# EasyEDA schematic NOR Flash Storage Module.json
TITLE: Sheet_1; REV: 1.0; Date: 2019-08-23; Sheet: 1/1; Company: Your Company
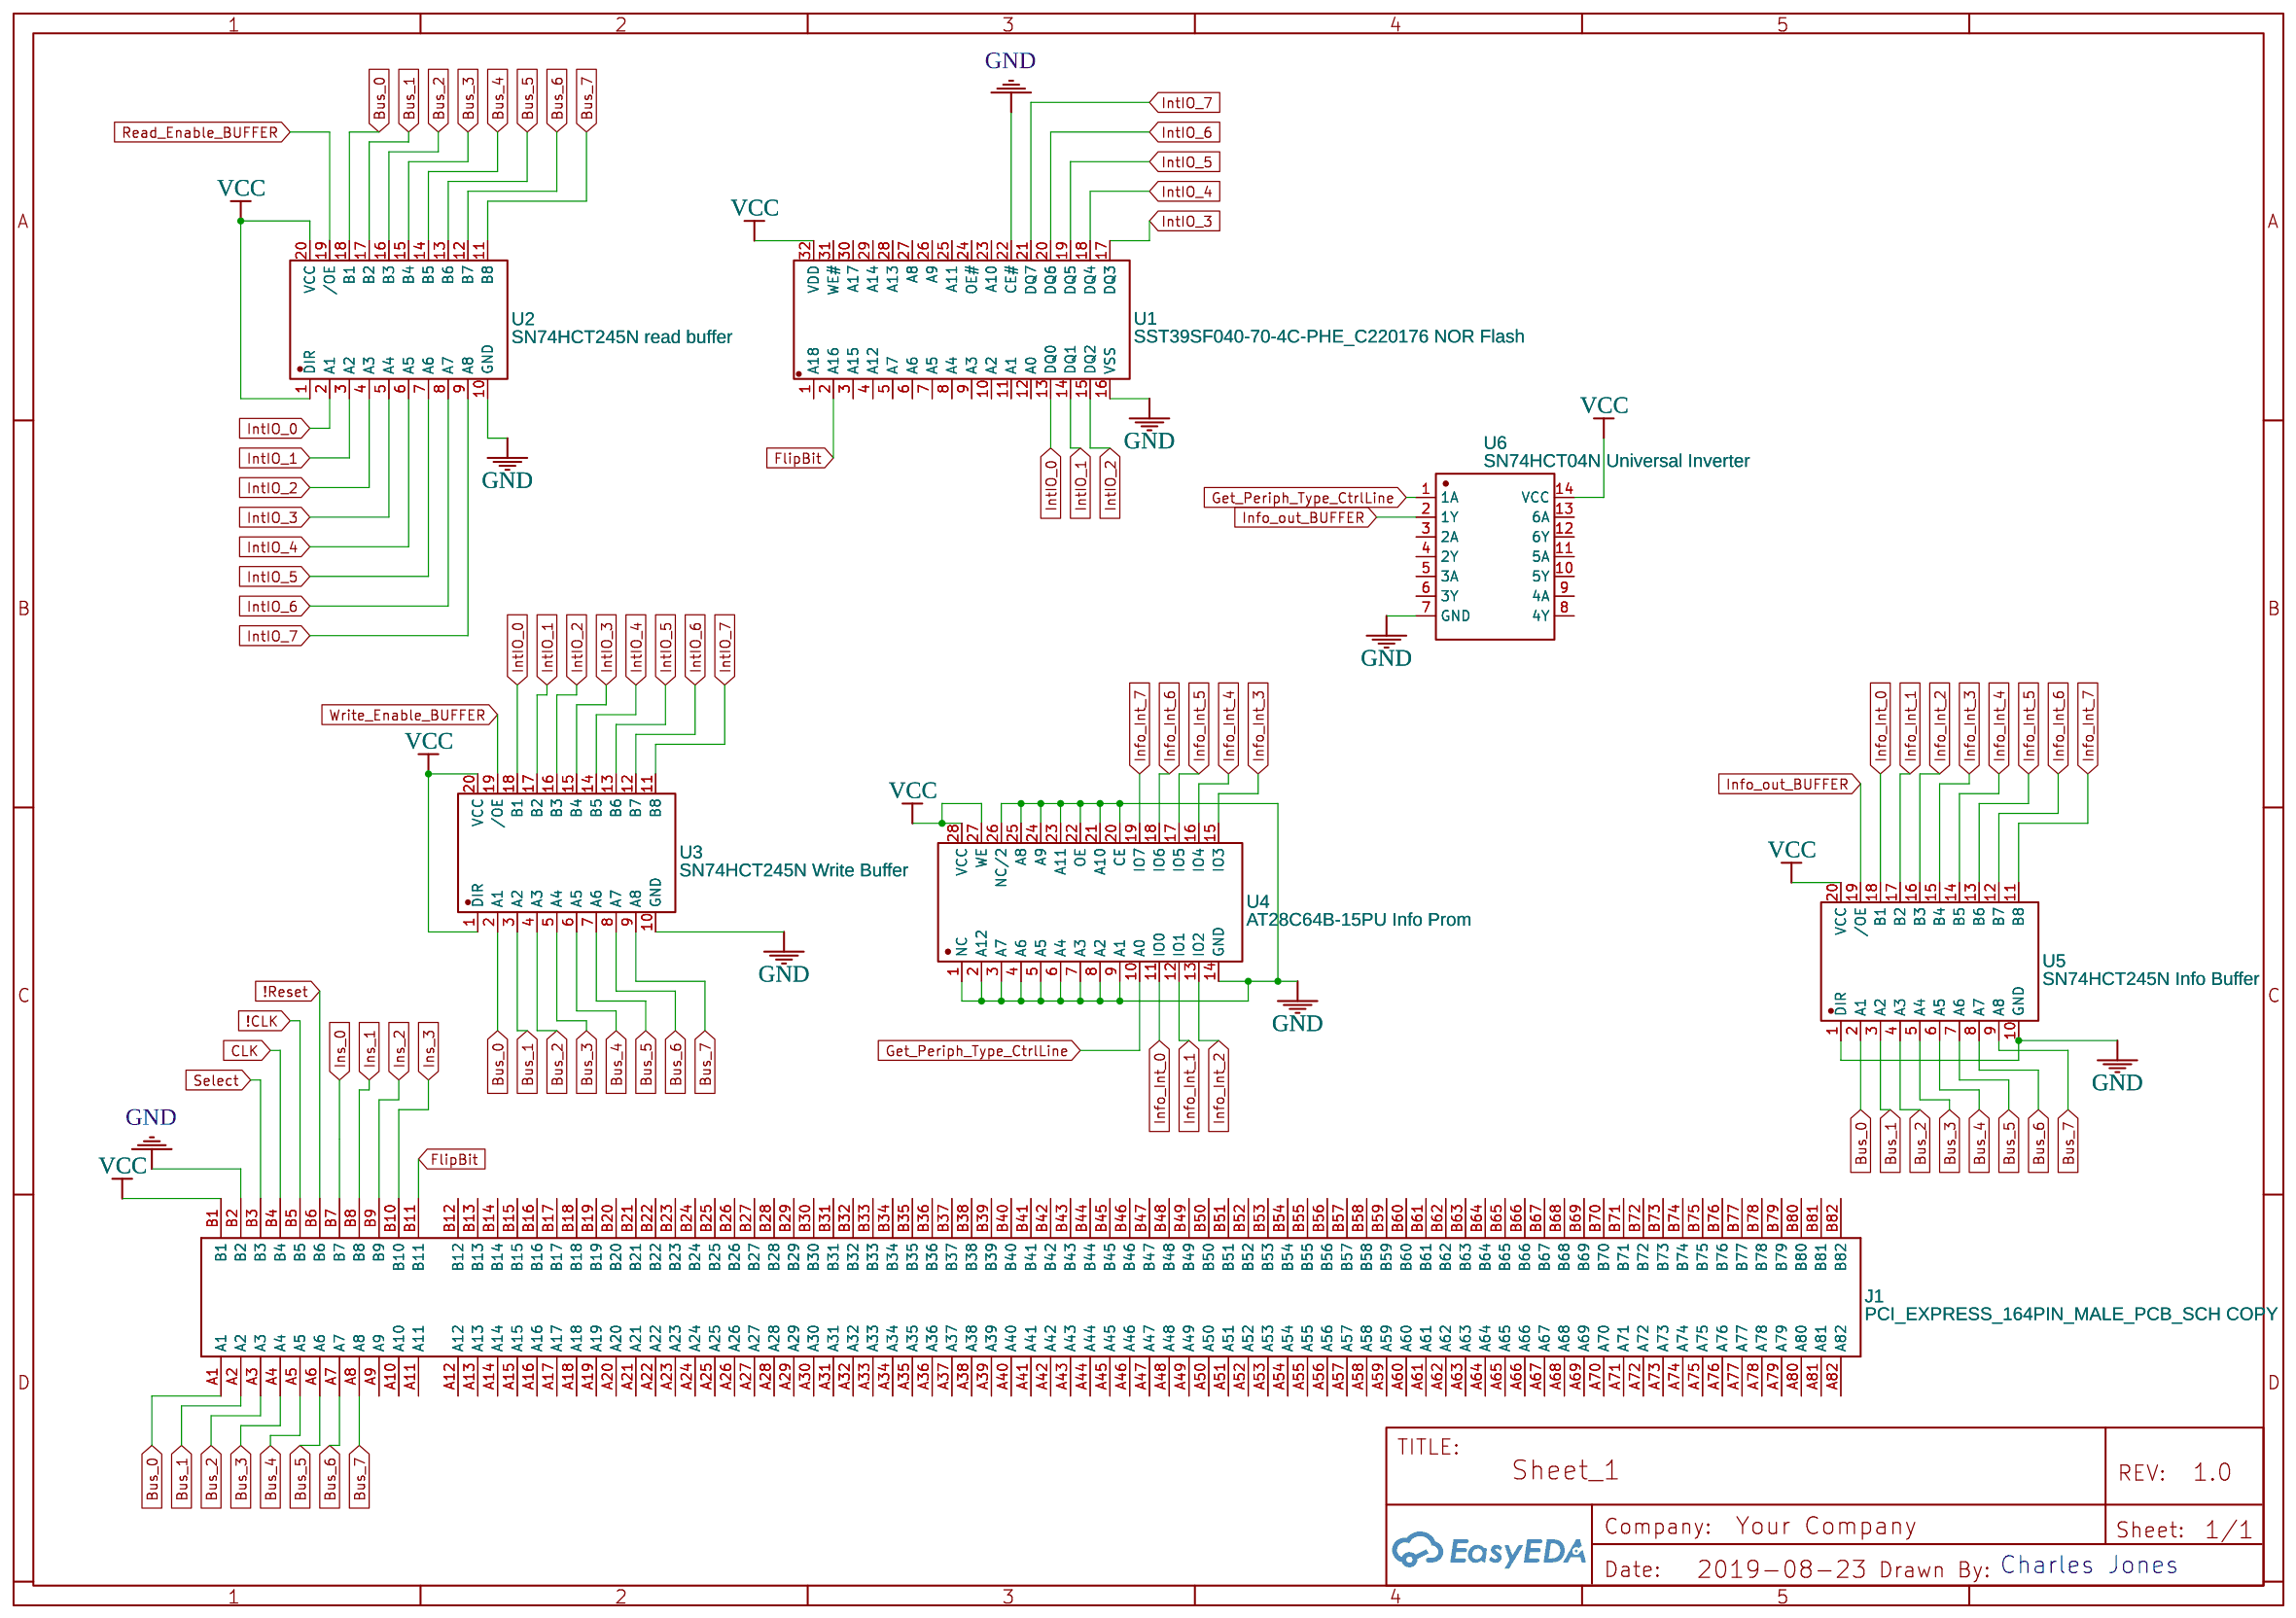
[diagram p0: schematic sheet]

## Parts
J1  PCI_EXPRESS_164PIN_MALE_PCB_SCH COPY  [PCI_EXPRESS_164PIN_MALE_PCB]
U1  SST39SF040-70-4C-PHE_C220176 NOR Flash  [DIP-32_600MIL]
U2  SN74HCT245N read buffer  [DIP-20_300MIL]
U3  SN74HCT245N Write Buffer  [DIP-20_300MIL]
U4  AT28C64B-15PU Info Prom  [DIP-28_600MIL]
U5  SN74HCT245N Info Buffer  [DIP-20_300MIL]
U6  SN74HCT04N Universal Inverter  [DIP14]

## Library data of the parts
J1 = -: Manufacturer Part: PCI_EXPRESS_PCB; Supplier Part: undefined; Contributor: Yadin
U1 = -: Supplier: LCSC; Supplier Part: C220176; Manufacturer: Microchip Tech; Manufacturer Part: SST39SF040-70-4C-PHE; Contributor: LCSC
U2 U3 U5 = -: Supplier: LCSC; Supplier Part: C133640; Manufacturer: Texas Instruments; Manufacturer Part: SN74HCT245N; Contributor: LCSC
U4 = -: Supplier: LCSC; Manufacturer: MICROCHIP; Manufacturer Part: AT28C64B-15PU; Supplier Part: C41982

## Nets
GND: J1.B2 U1.16(VSS) U1.22(CE#) U2.10(GND) U3.10(GND) U4.1(NC) U4.2(A12) U4.3(A7) U4.4(A6) U4.5(A5) U4.6(A4) U4.7(A3) U4.8(A2) U4.9(A1) U4.14(GND) U4.20(CE) U4.21(A10) U4.22(OE) U4.23(A11) U4.24(A9) U4.25(A8) U4.26(NC/2) U5.1(DIR) U5.10(GND) U6.7(GND)
VCC: J1.B1 U1.32(VDD) U2.1(DIR) U2.20(VCC) U3.1(DIR) U3.20(VCC) U4.27(WE) U4.28(VCC) U5.20(VCC) U6.14(VCC)
!CLK: J1.B5
!Reset: J1.B6
Bus_0: J1.A1 U2.18(B1) U3.2(A1) U5.2(A1)
Bus_1: J1.A2 U2.17(B2) U3.3(A2) U5.3(A2)
Bus_2: J1.A3 U2.16(B3) U3.4(A3) U5.4(A3)
Bus_3: J1.A4 U2.15(B4) U3.5(A4) U5.5(A4)
Bus_4: J1.A5 U2.14(B5) U3.6(A5) U5.6(A5)
Bus_5: J1.A6 U2.13(B6) U3.7(A6) U5.7(A6)
Bus_6: J1.A7 U2.12(B7) U3.8(A7) U5.8(A7)
Bus_7: J1.A8 U2.11(B8) U3.9(A8) U5.9(A8)
CLK: J1.B4
FlipBit: J1.B11 U1.2(A16)
Get_Periph_Type_CtrlLine: U4.10(A0) U6.1(1A)
Info_Int_0: U4.11(IO0) U5.18(B1)
Info_Int_1: U4.12(IO1) U5.17(B2)
Info_Int_2: U4.13(IO2) U5.16(B3)
Info_Int_3: U4.15(IO3) U5.15(B4)
Info_Int_4: U4.16(IO4) U5.14(B5)
Info_Int_5: U4.17(IO5) U5.13(B6)
Info_Int_6: U4.18(IO6) U5.12(B7)
Info_Int_7: U4.19(IO7) U5.11(B8)
Info_out_BUFFER: U5.19(/OE) U6.2(1Y)
Ins_0: J1.B7
Ins_1: J1.B8
Ins_2: J1.B9
Ins_3: J1.B10
IntIO_0: U1.13(DQ0) U2.2(A1) U3.18(B1)
IntIO_1: U1.14(DQ1) U2.3(A2) U3.17(B2)
IntIO_2: U1.15(DQ2) U2.4(A3) U3.16(B3)
IntIO_3: U1.17(DQ3) U2.5(A4) U3.15(B4)
IntIO_4: U1.18(DQ4) U2.6(A5) U3.14(B5)
IntIO_5: U1.19(DQ5) U2.7(A6) U3.13(B6)
IntIO_6: U1.20(DQ6) U2.8(A7) U3.12(B7)
IntIO_7: U1.21(DQ7) U2.9(A8) U3.11(B8)
Read_Enable_BUFFER: U2.19(/OE)
Select: J1.B3
Write_Enable_BUFFER: U3.19(/OE)

Not connected (* = marked no-connect by the designer): J1 A9 A10 A11 A12 A13 A14 A15 A16 A17 A18 A19 A20 A21 A22 A23 A24 A25 A26 A27 A28 A29 A30 A31 A32 A33 A34 A35 A36 A37 A38 A39 A40 A41 A42 A43 A44 A45 A46 A47 A48 A49 A50 A51 A52 A53 A54 A55 A56 A57 A58 A59 A60 A61 A62 A63 A64 A65 A66 A67 A68 A69 A70 A71 A72 A73 A74 A75 A76 A77 A78 A79 A80 A81 A82 B12 B13 B14 B15 B16 B17 B18 B19 B20 B21 B22 B23 B24 B25 B26 B27 B28 B29 B30 B31 B32 B33 B34 B35 B36 B37 B38 B39 B40 B41 B42 B43 B44 B45 B46 B47 B48 B49 B50 B51 B52 B53 B54 B55 B56 B57 B58 B59 B60 B61 B62 B63 B64 B65 B66 B67 B68 B69 B70 B71 B72 B73 B74 B75 B76 B77 B78 B79 B80 B81 B82; U1 1(A18) 3(A15) 4(A12) 5(A7) 6(A6) 7(A5) 8(A4) 9(A3) 10(A2) 11(A1) 12(A0) 23(A10) 24(OE#) 25(A11) 26(A9) 27(A8) 28(A13) 29(A14) 30(A17) 31(WE#); U6 3(2A) 4(2Y) 5(3A) 6(3Y) 8(4Y) 9(4A) 10(5Y) 11(5A) 12(6Y) 13(6A)

## Notes on the sheet
- Charles Jones
